# Altium schematic sheet RP2040_Conn.SchDoc: Prometheus
size A; DrawnBy: Akio M; Organization: DERC CanSat PJ; Revision: 1; SheetNumber: 1; SheetTotal: 3
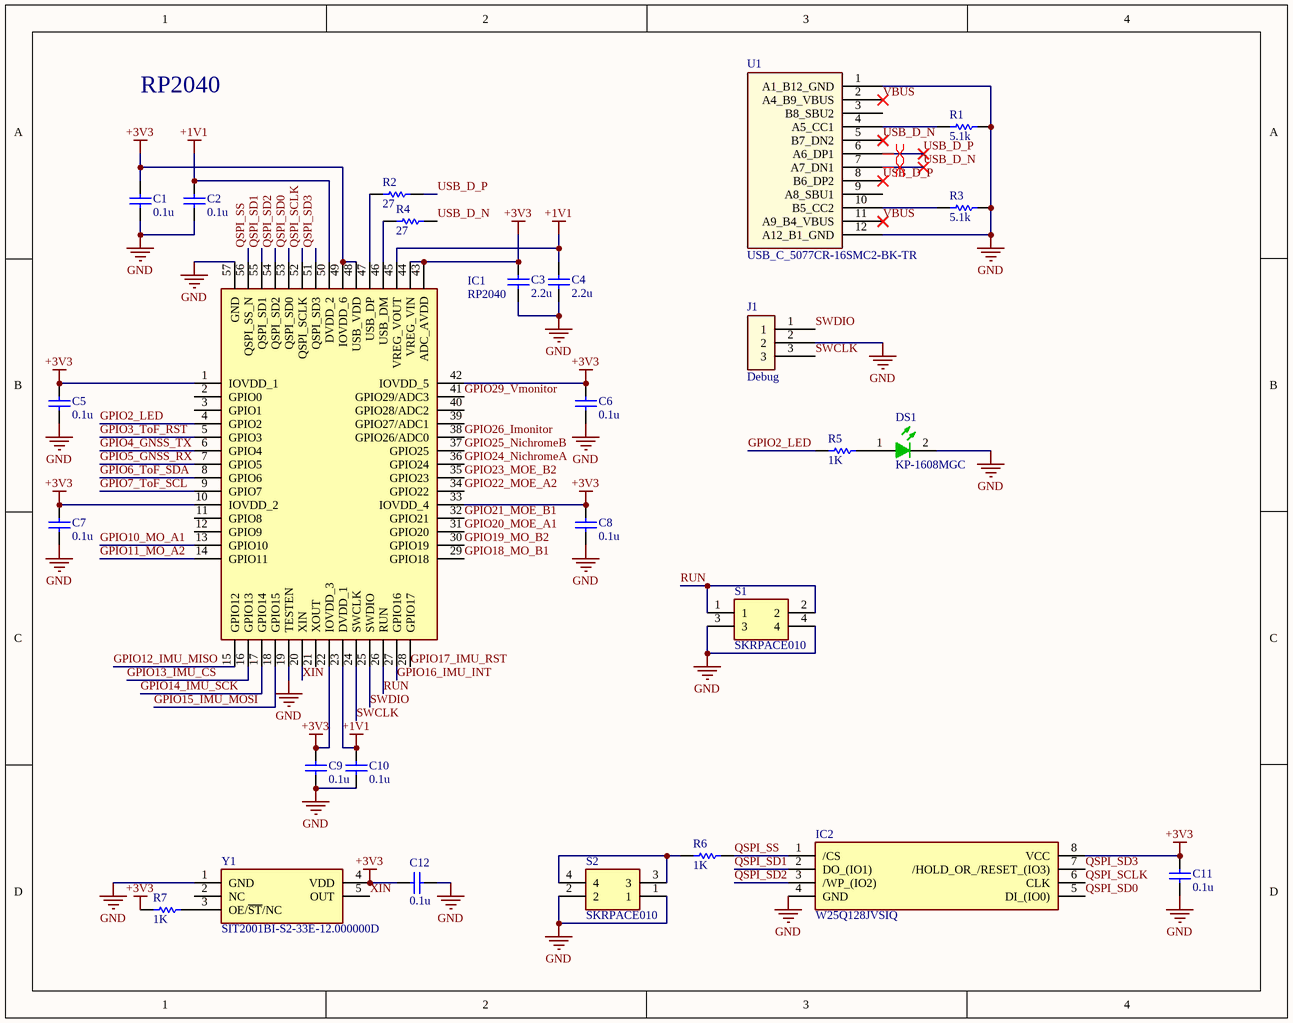
[diagram p0: RP2040_Conn.SchDoc]

## Parts
C1  value 0.1u  [1608[0603]]  (hidden comment: Capacitor)
C2  value 0.1u  [1608[0603]]  (hidden comment: Capacitor)
C3  value 2.2u  [1608[0603]]  (hidden comment: Capacitor)
C4  value 2.2u  [1608[0603]]  (hidden comment: Capacitor)
C5  value 0.1u  [1608[0603]]  (hidden comment: Capacitor)
C6  value 0.1u  [1608[0603]]  (hidden comment: Capacitor)
C7  value 0.1u  [1608[0603]]  (hidden comment: Capacitor)
C8  value 0.1u  [1608[0603]]  (hidden comment: Capacitor)
C9  value 0.1u  [1608[0603]]  (hidden comment: Capacitor)
C10  value 0.1u  [1608[0603]]  (hidden comment: Capacitor)
C11  value 0.1u  [1608[0603]]  (hidden comment: Capacitor)
C12  value 0.1u  [1608[0603]]  (hidden comment: Capacitor)
DS1  KP-1608MGC  [KING-0603LED_GREEN_V]
IC1  RP2040  [QFN40P700X700X90-57N-D]
IC2  W25Q128JVSIQ  [SOIC127P790X216-8N]
J1  Debug  [PinHeader_0.65_3_Half]
R1  value 5.1k  [1608[0603]]  (hidden comment: Resistor)
R2  value 27  [1608[0603]]  (hidden comment: Resistor)
R3  value 5.1k  [1608[0603]]  (hidden comment: Resistor)
R4  value 27  [1608[0603]]  (hidden comment: Resistor)
R5  value 1K  [1608[0603]]  (hidden comment: Resistor)
R6  value 1K  [1608[0603]]  (hidden comment: Resistor)
R7  value 1K  [1608[0603]]  (hidden comment: Resistor)
S1  SKRPACE010  [SMT(4.2X3.2)]
S2  SKRPACE010  [SMT(4.2X3.2)]
U1  USB_C_5077CR-16SMC2-BK-TR  [USB_C_5077CR-16SMC2-BK-TR]
Y1  SIT2001BI-S2-33E-12.000000D  [SOT95P280X145-5N]

## Nets
+1V1: C2.2 C4.2 C10.1 IC1.23(DVDD_1) IC1.45(VREG_VOUT) IC1.50(DVDD_2)
+3V3: C1.2 C3.2 C5.2 C6.1 C7.1 C8.1 C9.1 C11.2 C12.1 IC1.1(IOVDD_1) IC1.10(IOVDD_2) IC1.22(IOVDD_3) IC1.33(IOVDD_4) IC1.42(IOVDD_5) IC1.43(ADC_AVDD) IC1.44(VREG_VIN) IC1.48(USB_VDD) IC1.49(IOVDD_6) IC2.8(VCC) R7.1 Y1.4(VDD)
GND: C1.1 C2.1 C3.1 C4.1 C5.1 C6.2 C7.2 C8.2 C9.2 C10.2 C11.1 C12.2 DS1.2(K) IC1.19(TESTEN) IC1.57(GND) IC2.4(GND) J1.2 R1.2 R3.2 S1.3 S1.4 S2.1 S2.2 U1.1(A1_B12_GND) U1.12(A12_B1_GND) Y1.1(GND)
GPIO2_LED: IC1.4(GPIO2) R5.1
GPIO3_ToF_RST: IC1.5(GPIO3)
GPIO4_GNSS_TX: IC1.6(GPIO4)
GPIO5_GNSS_RX: IC1.7(GPIO5)
GPIO6_ToF_SDA: IC1.8(GPIO6)
GPIO7_ToF_SCL: IC1.9(GPIO7)
GPIO10_MO_A1: IC1.13(GPIO10)
GPIO11_MO_A2: IC1.14(GPIO11)
GPIO12_IMU_MISO: IC1.15(GPIO12)
GPIO13_IMU_CS: IC1.16(GPIO13)
GPIO14_IMU_SCK: IC1.17(GPIO14)
GPIO15_IMU_MOSI: IC1.18(GPIO15)
GPIO16_IMU_INT: IC1.27(GPIO16)
GPIO17_IMU_RST: IC1.28(GPIO17)
GPIO18_MO_B1: IC1.29(GPIO18)
GPIO19_MO_B2: IC1.30(GPIO19)
GPIO20_MOE_A1: IC1.31(GPIO20)
GPIO21_MOE_B1: IC1.32(GPIO21)
GPIO22_MOE_A2: IC1.34(GPIO22)
GPIO23_MOE_B2: IC1.35(GPIO23)
GPIO24_NichromeA: IC1.36(GPIO24)
GPIO25_NichromeB: IC1.37(GPIO25)
GPIO26_Imonitor: IC1.38(GPIO26/ADC0)
GPIO29_Vmonitor: IC1.41(GPIO29/ADC3)
QSPI_SCLK: IC1.52(QSPI_SCLK) IC2.6(CLK)
QSPI_SD0: IC1.53(QSPI_SD0) IC2.5(DI_(IO0))
QSPI_SD1: IC1.55(QSPI_SD1) IC2.2(DO_(IO1))
QSPI_SD2: IC1.54(QSPI_SD2) IC2.3(/WP_(IO2))
QSPI_SD3: IC1.51(QSPI_SD3) IC2.7(/HOLD_OR_/RESET_(IO3))
QSPI_SS: IC1.56(QSPI_SS_N) IC2.1(/CS) R6.2
RUN: IC1.26(RUN) S1.1 S1.2
SWCLK: IC1.24(SWCLK) J1.3
SWDIO: IC1.25(SWDIO) J1.1
USB_D_N: R4.2 U1.5(B7_DN2) U1.7(A7_DN1)
USB_D_P: R2.2 U1.6(A6_DP1) U1.8(B6_DP2)
VBUS: U1.2(A4_B9_VBUS) U1.11(A9_B4_VBUS)
XIN: IC1.20(XIN) Y1.5(OUT)
NetDS1_1: DS1.1(A) R5.2
NetIC1_46: IC1.46(USB_DM) R4.1
NetIC1_47: IC1.47(USB_DP) R2.1
NetR1_1: R1.1 U1.4(A5_CC1)
NetR3_1: R3.1 U1.10(B5_CC2)
NetR6_1: R6.1 S2.3 S2.4
NetR7_2: R7.2 Y1.3(OE/~{ST}/NC)

Not connected (* = marked no-connect by the designer): IC1 2(GPIO0) 3(GPIO1) 11(GPIO8) 12(GPIO9) 21(XOUT) 39(GPIO27/ADC1) 40(GPIO28/ADC2); U1 3(B8_SBU2) 9(A8_SBU1); Y1 2(NC)

## Layout directives
differential pair: USB_D_N, USB_D_P

## Notes on the sheet
- RP2040

## Library data of the parts
C1-C12 = Capacitor: SimulationGenericComponent: True
DS1 = CMP-0404-00001-1: LED, SMT, 0603(1608), 1.1mm thickness, Green; Manufacturer: Kingbright; Reverse Voltage: 5 V; Power Dissipation: 75 mW; Forward Current: 30 mA; Packing Type: 2000 pcs / reel; Mounting Technology: Surface Mount; Storage Temperature: -40 to +85 degC; ComponentLink1URL: http://www.kingbright.com/; PackageDescription: 2-Pin SMT LED, 1.6 x 0.8 mm Pitch; PartNumber: KP-1608MGC; PackageReference: 0603LED_GREEN; ComponentLink1Description: Manufacturer URL
IC1 = RP2040: Integrated Circuit; Manufacturer_Name: RASPBERRY-PI; Datasheet Link: https://datasheets.raspberrypi.org/rp2040/rp2040-datasheet.pdf; Height: 0.9mm; Manufacturer_Part_Number: RP2040
IC2 = W25Q128JVSIQ: Integrated Circuit; Manufacturer_Name: Winbond; Datasheet Link: https://www.winbond.com/hq/search-resource-file.jsp?partNo=W25Q128JVSIQ&type=datasheet; Height: 2.16mm; Manufacturer_Part_Number: W25Q128JVSIQ; Mouser Part Number: 454-W25Q128JVSIQ; Mouser Price/Stock: https://www.mouser.co.uk/ProductDetail/Winbond/W25Q128JVSIQ?qs=qSfuJ%252Bfl%2Fd6tLXvPR4fl9w%3D%3D; Arrow Part Number: W25Q128JVSIQ; Arrow Price/Stock: https://www.arrow.com/en/products/w25q128jvsiq/winbond-electronics?region=nac
J1 = PinHeader_0.65_3_Half
R1-R7 = Resistor: TC1: 0; SimulationGenericComponent: True; TC2: 0
S1 S2 = SKRPACE010: Switch; Manufacturer_Name: ALPS Electric; Datasheet Link: http://www.alps.com/prod/info/E/HTML/Tact/SurfaceMount/SKRP/SKRPACE010.html; Manufacturer_Part_Number: SKRPACE010; Mouser Part Number: 688-SKRPACE010; Mouser Price/Stock: https://www.mouser.co.uk/ProductDetail/Alps-Alpine/SKRPACE010?qs=dHDuPHwQO79W8iY66hDbLQ%3D%3D; Arrow Part Number: SKRPACE010; Arrow Price/Stock: https://www.arrow.com/en/products/skrpace010/alps-electric
Y1 = SIT2001BI-S2-33E-12.000000D: Crystal or Oscillator; Manufacturer_Name: SiTime; Datasheet Link: https://www.sitime.com/datasheet/SiT2001; Height: 1.45mm; Manufacturer_Part_Number: SIT2001BI-S2-33E-12.000000D